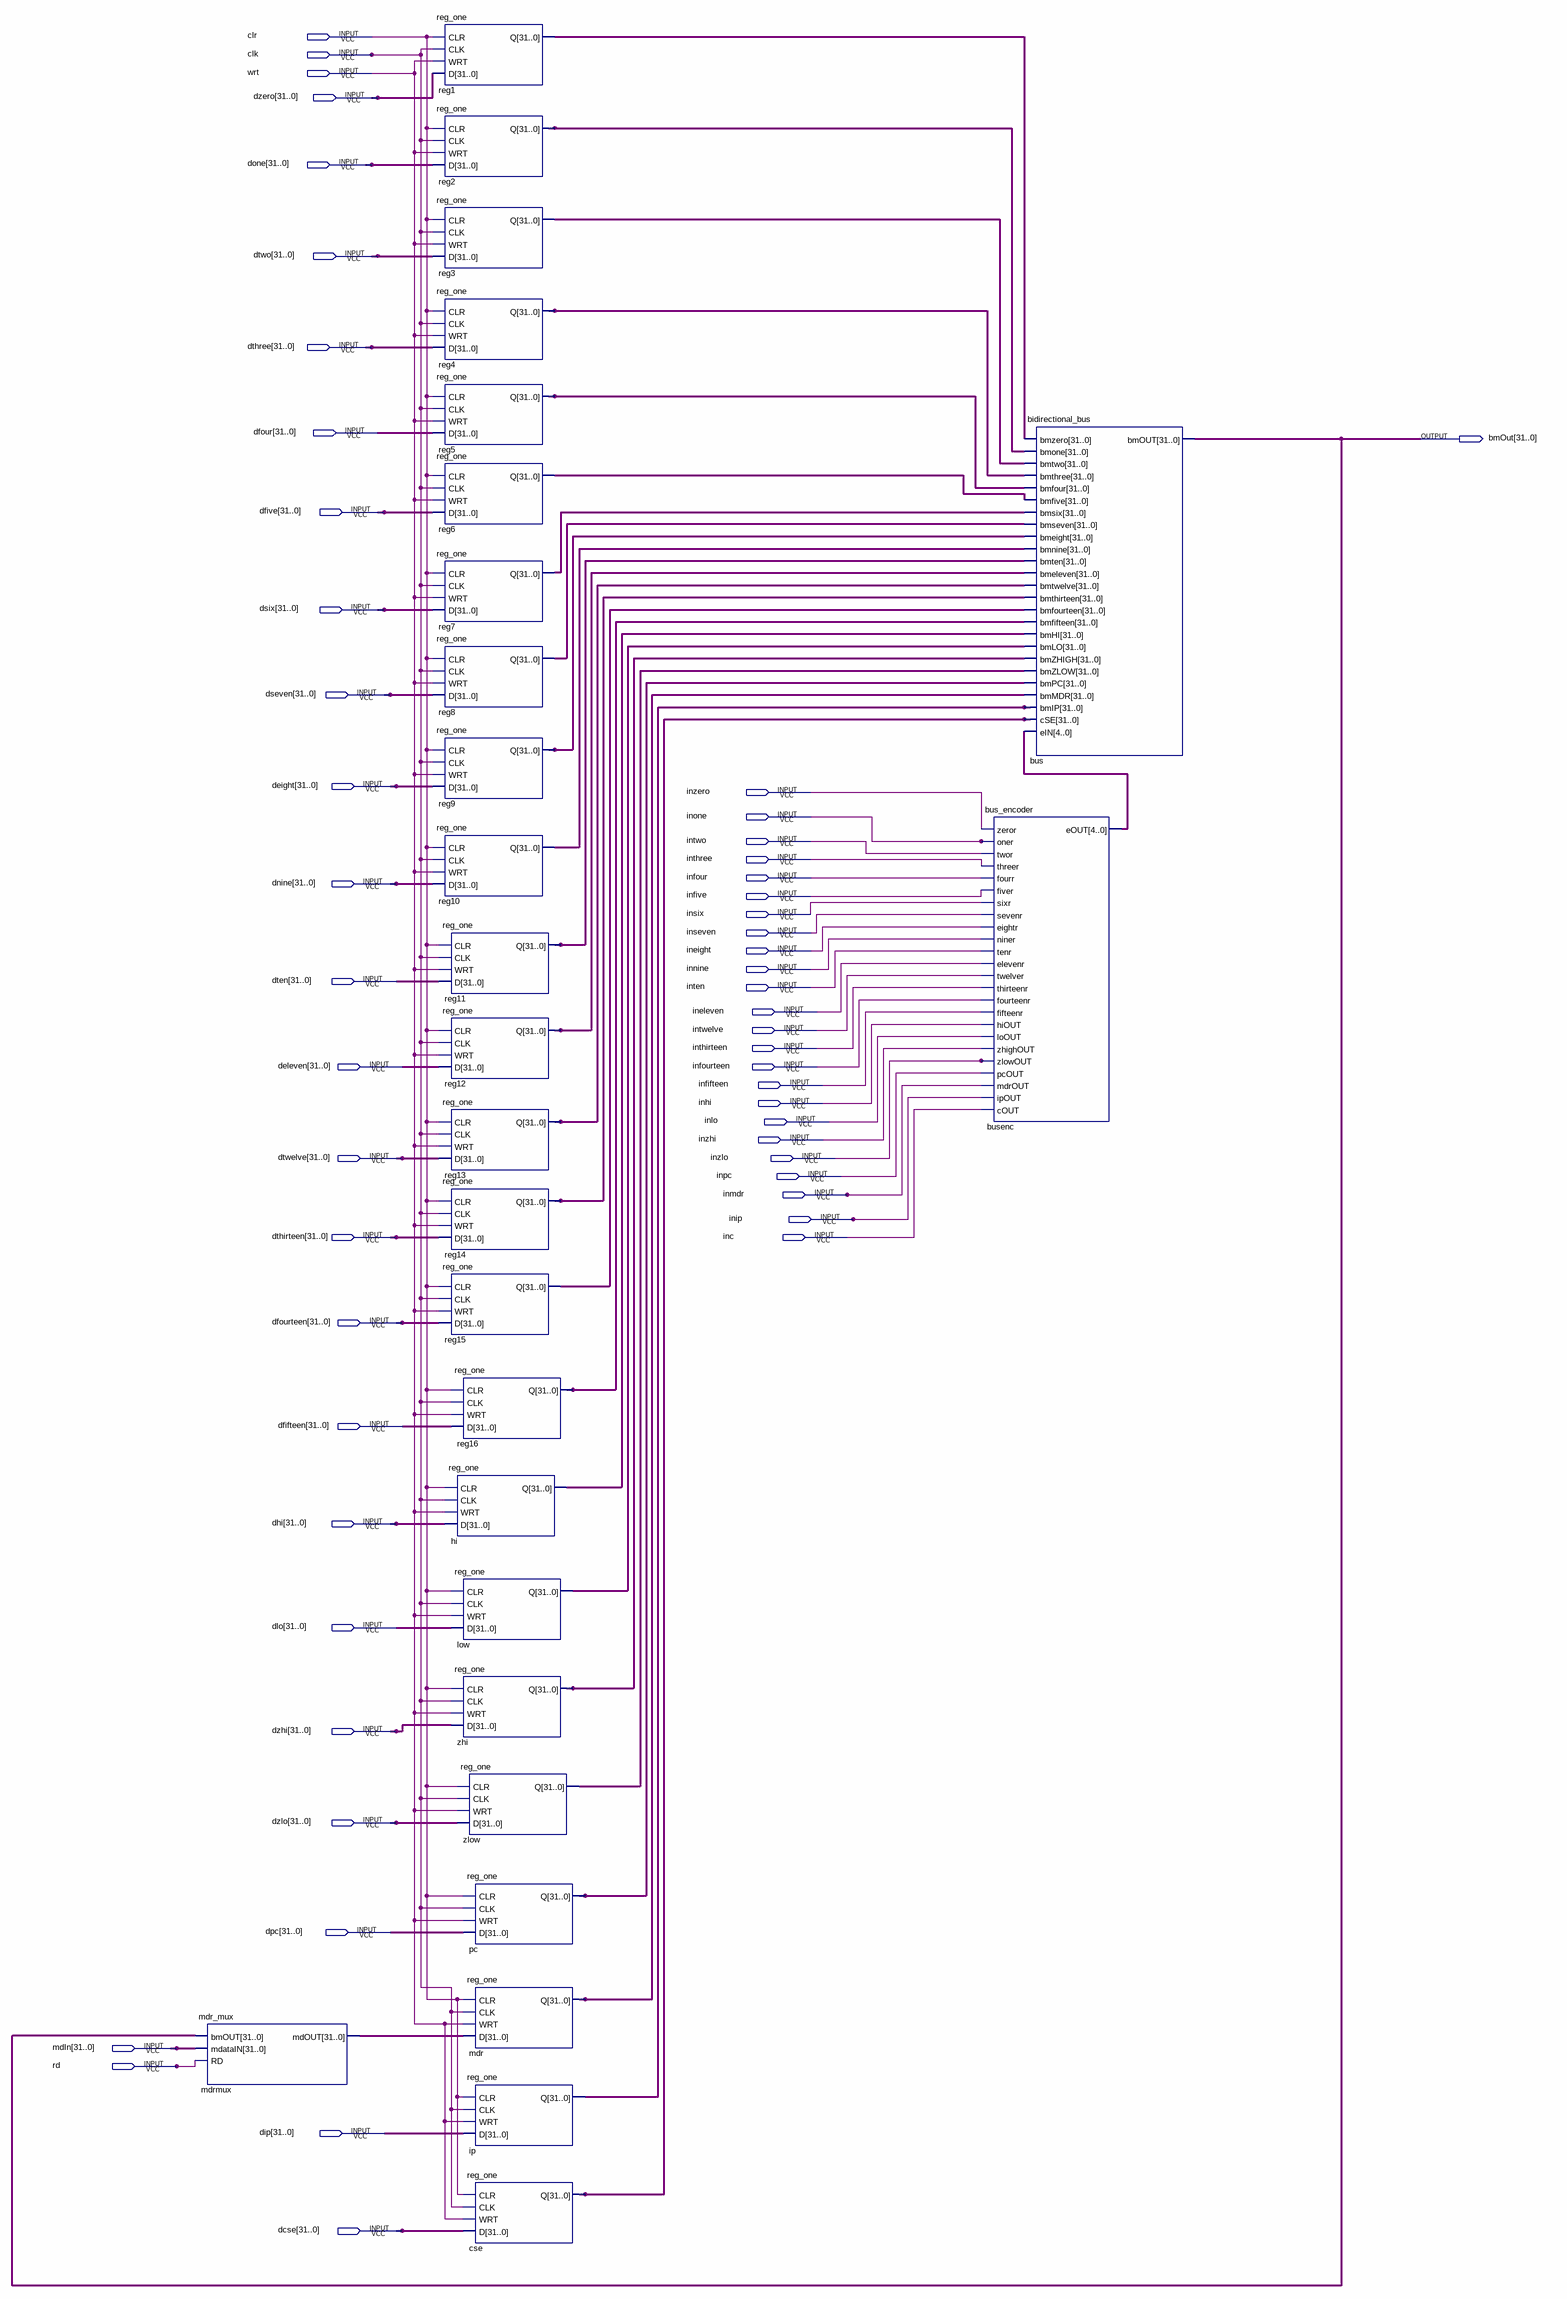
[diagram p0: schematic sheet]
// Quartus schematic the_bus.bdf as structural Verilog: 27 symbols, 53 pins
module the_bus (
  input  clr,
  input  clk,
  input  wrt,
  input  [31:0] dzero,
  input  [31:0] done,
  input  [31:0] dtwo,
  input  [31:0] dthree,
  input  [31:0] dfour,
  input  [31:0] dfive,
  input  [31:0] dsix,
  input  [31:0] dseven,
  input  [31:0] deight,
  input  inzero,
  input  inone,
  input  intwo,
  input  inthree,
  input  infour,
  input  [31:0] dnine,
  input  infive,
  input  insix,
  input  inseven,
  input  ineight,
  input  innine,
  input  [31:0] dten,
  input  inten,
  input  ineleven,
  input  intwelve,
  input  inthirteen,
  input  [31:0] deleven,
  input  infourteen,
  input  infifteen,
  input  inhi,
  input  inlo,
  input  inzhi,
  input  [31:0] dtwelve,
  input  inzlo,
  input  inpc,
  input  inmdr,
  input  inip,
  input  [31:0] dthirteen,
  input  inc,
  input  [31:0] dfourteen,
  input  [31:0] dfifteen,
  input  [31:0] dhi,
  input  [31:0] dlo,
  input  [31:0] dzhi,
  input  [31:0] dzlo,
  input  [31:0] dpc,
  input  [31:0] mdIn,
  input  rd,
  input  [31:0] dip,
  input  [31:0] dcse,
  output [31:0] bmOut
);

  wire [4:0] busenc_eout;
  wire [31:0] cse_q, hi_q, ip_q, low_q, mdr_q, mdrmux_mdout, pc_q, reg1_q, reg2_q, reg3_q, reg4_q, reg5_q,
       reg6_q, reg7_q, reg8_q, reg9_q, reg10_q, reg11_q, reg12_q, reg13_q, reg14_q, reg15_q, reg16_q, zhi_q,
       zlow_q;

  mdr_mux mdrmux (.bmOUT(bmOut), .mdataIN(mdIn), .RD(rd), .mdOUT(mdrmux_mdout));
  reg_one reg1 (.CLR(clr), .CLK(clk), .WRT(wrt), .D(dzero), .Q(reg1_q));
  reg_one reg2 (.CLR(clr), .CLK(clk), .WRT(wrt), .D(done), .Q(reg2_q));
  reg_one reg3 (.CLR(clr), .CLK(clk), .WRT(wrt), .D(dtwo), .Q(reg3_q));
  reg_one reg4 (.CLR(clr), .CLK(clk), .WRT(wrt), .D(dthree), .Q(reg4_q));
  reg_one reg5 (.CLR(clr), .CLK(clk), .WRT(wrt), .D(dfour), .Q(reg5_q));
  reg_one reg6 (.CLR(clr), .CLK(clk), .WRT(wrt), .D(dfive), .Q(reg6_q));
  reg_one reg7 (.CLR(clr), .CLK(clk), .WRT(wrt), .D(dsix), .Q(reg7_q));
  reg_one reg8 (.CLR(clr), .CLK(clk), .WRT(wrt), .D(dseven), .Q(reg8_q));
  reg_one reg9 (.CLR(clr), .CLK(clk), .WRT(wrt), .D(deight), .Q(reg9_q));
  reg_one reg10 (.CLR(clr), .CLK(clk), .WRT(wrt), .D(dnine), .Q(reg10_q));
  reg_one reg11 (.CLR(clr), .CLK(clk), .WRT(wrt), .D(dten), .Q(reg11_q));
  reg_one reg12 (.CLR(clr), .CLK(clk), .WRT(wrt), .D(deleven), .Q(reg12_q));
  reg_one reg13 (.CLR(clr), .CLK(clk), .WRT(wrt), .D(dtwelve), .Q(reg13_q));
  reg_one reg14 (.CLR(clr), .CLK(clk), .WRT(wrt), .D(dthirteen), .Q(reg14_q));
  reg_one reg15 (.CLR(clr), .CLK(clk), .WRT(wrt), .D(dfourteen), .Q(reg15_q));
  reg_one reg16 (.CLR(clr), .CLK(clk), .WRT(wrt), .D(dfifteen), .Q(reg16_q));
  reg_one hi (.CLR(clr), .CLK(clk), .WRT(wrt), .D(dhi), .Q(hi_q));
  reg_one low (.CLR(clr), .CLK(clk), .WRT(wrt), .D(dlo), .Q(low_q));
  reg_one zhi (.CLR(clr), .CLK(clk), .WRT(wrt), .D(dzhi), .Q(zhi_q));
  reg_one zlow (.CLR(clr), .CLK(clk), .WRT(wrt), .D(dzlo), .Q(zlow_q));
  reg_one pc (.CLR(clr), .CLK(clk), .WRT(wrt), .D(dpc), .Q(pc_q));
  reg_one mdr (.CLR(clr), .CLK(clk), .WRT(wrt), .D(mdrmux_mdout), .Q(mdr_q));
  reg_one ip (.CLR(clr), .CLK(clk), .WRT(wrt), .D(dip), .Q(ip_q));
  reg_one cse (.CLR(clr), .CLK(clk), .WRT(wrt), .D(dcse), .Q(cse_q));
  bus_encoder busenc (
    .zeror(inzero), .oner(inone), .twor(intwo), .threer(inthree), .fourr(infour), .fiver(infive),
    .sixr(insix), .sevenr(inseven), .eightr(ineight), .niner(innine), .tenr(inten), .elevenr(ineleven),
    .twelver(intwelve), .thirteenr(inthirteen), .fourteenr(infourteen), .fifteenr(infifteen), .hiOUT(inhi),
    .loOUT(inlo), .zhighOUT(inzhi), .zlowOUT(inzlo), .pcOUT(inpc), .mdrOUT(inmdr), .ipOUT(inip), .cOUT(inc),
    .eOUT(busenc_eout));
  bidirectional_bus bus (
    .bmzero(reg1_q), .bmone(reg2_q), .bmtwo(reg3_q), .bmthree(reg4_q), .bmfour(reg5_q), .bmfive(reg6_q),
    .bmsix(reg7_q), .bmseven(reg8_q), .bmeight(reg9_q), .bmnine(reg10_q), .bmten(reg11_q),
    .bmeleven(reg12_q), .bmtwelve(reg13_q), .bmthirteen(reg14_q), .bmfourteen(reg15_q), .bmfifteen(reg16_q),
    .bmHI(hi_q), .bmLO(low_q), .bmZHIGH(zhi_q), .bmZLOW(zlow_q), .bmPC(pc_q), .bmMDR(mdr_q), .bmIP(ip_q),
    .cSE(cse_q), .eIN(busenc_eout), .bmOUT(bmOut));
endmodule
